# Altium project Yukitora.PrjPcb (part 1 of 5)
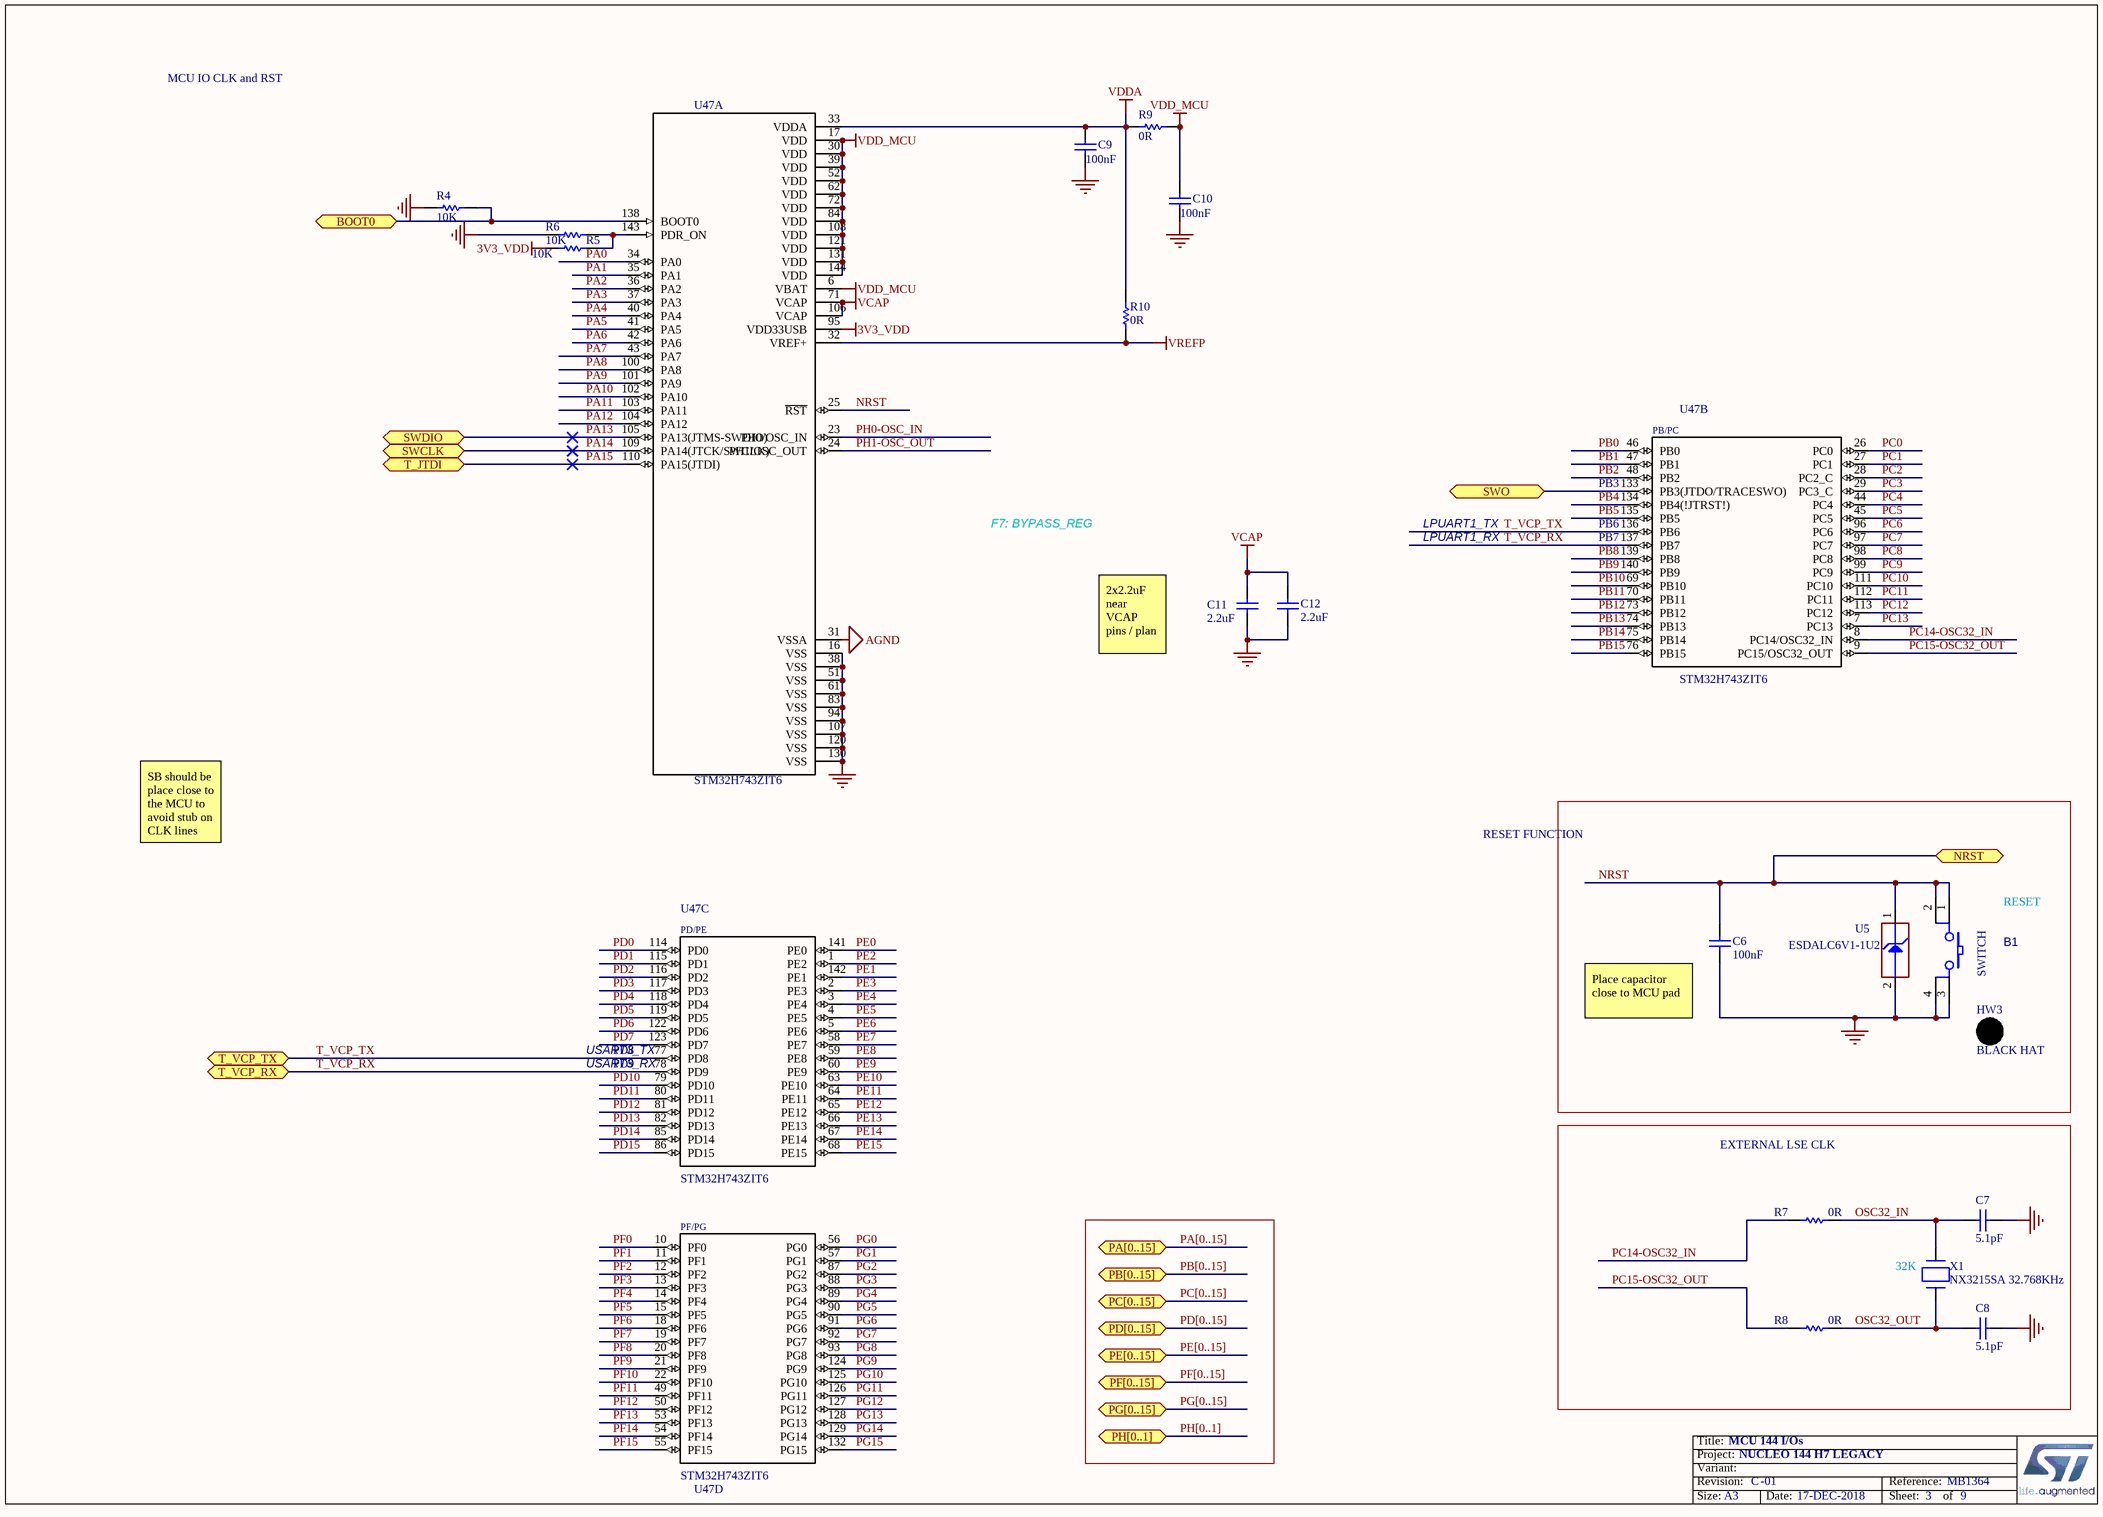
[diagram p0: MCU_144_IOs.SchDoc]
Board_Assembly_Revision: 01; Board_Document_Date: 17-DEC-2018; Board_Name: NUCLEO 144 H7 LEGACY; Board_PCB_Revision: C; Board_Reference: MB1364
17 sheets, 317 parts. Net scope: flat (ports and power ports of the same name join across sheets).
Board file: Yukitora.PcbDoc
Sheets:
  MCU_144_IOs.SchDoc
  MCU_144_POWER.SchDoc
  Power_Board.SchDoc
  ST_LINK_V3E.SchDoc
  Heater.SchDoc
  SynchDemod.SchDoc
  Levels.SchDoc
  12V_Supply.SchDoc
  Bluetooth.SchDoc
  Power.SchDoc
  Force_Plates_Power_Supply.SchDoc
  Conning_Tower.SchDoc
  ZPZH.SchDoc
  Encoder.SchDoc
  Motors.SchDoc
  AD717-2.SchDoc
  SYS_PWR_ADC.SchDoc

## Sheet MCU_144_IOs.SchDoc: MCU 144 I/Os
size A3; Date: Not used; ApprovedBy: Not used; CheckedBy: Not used; Author: Not used; CompanyName: STMicroelectronics; DrawnBy: Not used; Engineer: Not used; Organization: Not used; Address1: Not used; Address2: Not used; Address3: Not used; Address4: Not used; DocumentNumber: 3; Revision: Not used; SheetNumber: 3; SheetTotal: 9; CurrentTime: Not used; CurrentDate: Not used; Time: Not used; DocumentFullPathAndName: Not used; DocumentName: Not used; ModifiedDate: Not used; ImagePath: Not used; ProjectName: Not used; Application_BuildNumber: Not used

### Parts
B1  value SWITCH  [SWI_WEALTHMETAL_TD-0341_4P_BLACK]  (hidden comment: SW-PUSH-CMS)
C6  value 100nF  [C0603]  (hidden comment: Capacitor)
C7  value 5.1pF  [C0402]  (hidden comment: Capacitor)
C8  value 5.1pF  [C0402]  (hidden comment: Capacitor)
C9  Capacitance: 100nF  [C0402]  (hidden comment: Capacitor)
C10  Capacitance: 100nF  [C0402]  (hidden comment: Capacitor)
C11  value 2.2uF  [C0603]  (hidden comment: Capacitor)
C12  value 2.2uF  [C0603]  (hidden comment: Capacitor)
HW3  value BLACK HAT  (hidden comment: BUTTON_HAT_BLACK)  (mechanical)
R4  value 10K  [R0603]  (hidden comment: Resistor)
R5  value 10K  [R0603]  (hidden comment: Resistor)
R6  value 10K  [R0603]  (hidden comment: Resistor)
R7  value 0R  [R0603]  (hidden comment: Resistor)
R8  value 0R  [R0603]  (hidden comment: Resistor)
R9  value 0R  [R0603]  (hidden comment: Resistor)
R10  value 0R  [R0603]  (hidden comment: Resistor)
U5  value ESDALC6V1-1U2  [ESD_ST0201]  (hidden comment: ESD-TRANSIL)
U47  STM32H743ZIT6  [*QFP50P2200X2200X160-144N]  (parts A,B,C,D of 4)
X1  value NX3215SA 32.768KHz  [CRY_NX3215SA_2P]  (hidden comment: XTAL_2_PINS)

### Ports
BOOT0 (bidir), NRST (bidir), PA[0..15] (bidir), PB[0..15] (bidir), PC[0..15] (bidir), PD[0..15] (bidir), PE[0..15] (bidir), PF[0..15] (bidir), PG[0..15] (bidir), PH[0..1] (bidir), SWCLK (bidir), SWDIO (bidir), SWO (bidir), T_JTDI (bidir), T_VCP_RX (bidir), T_VCP_TX (bidir)

### Nets
3V3_VDD: R5.2 U47.95(VDD33USB)
AGND: U47.31(VSSA)
GND: B1.3 B1.4 C6.1 C7.2 C8.2 C9.1 C10.1 C11.1 C12.1 R4.2 R6.2 U5.2(GND) U47.16(VSS) U47.38(VSS) U47.51(VSS) U47.61(VSS) U47.83(VSS) U47.94(VSS) U47.107(VSS) U47.120(VSS) U47.130(VSS)
VCAP: C11.2 C12.2 U47.71(VCAP) U47.106(VCAP)
VDD_MCU: C10.2 R9.2 U47.6(VBAT) U47.17(VDD) U47.30(VDD) U47.39(VDD) U47.52(VDD) U47.62(VDD) U47.72(VDD) U47.84(VDD) U47.108(VDD) U47.121(VDD) U47.131(VDD) U47.144(VDD)
VDDA: C9.2 R9.1 R10.1 U47.33(VDDA)
VREFP: R10.2 U47.32(VREF+)
BOOT0: R4.1 U47.138(BOOT0) ; port BOOT0
NRST: B1.1 B1.2 C6.2 U5.1(IO1) U47.25(~{RST}) ; port NRST
OSC32_IN: C7.1 R7.2 X1.2(X2)
OSC32_OUT: C8.1 R8.2 X1.1(X1)
PA0: U47.34(PA0)
PA1: U47.35(PA1)
PA2: U47.36(PA2)
PA3: U47.37(PA3)
PA4: U47.40(PA4)
PA5: U47.41(PA5)
PA6: U47.42(PA6)
PA7: U47.43(PA7)
PA8: U47.100(PA8)
PA9: U47.101(PA9)
PA10: U47.102(PA10)
PA11: U47.103(PA11)
PA12: U47.104(PA12)
PA13: U47.105(PA13(JTMS-SWDIO)) ; port SWDIO
PA14: U47.109(PA14(JTCK/SWCLK)) ; port SWCLK
PA15: U47.110(PA15(JTDI)) ; port T_JTDI
PB0: U47.46(PB0)
PB1: U47.47(PB1)
PB2: U47.48(PB2)
PB4: U47.134(PB4(!JTRST!))
PB5: U47.135(PB5)
PB8: U47.139(PB8)
PB9: U47.140(PB9)
PB10: U47.69(PB10)
PB11: U47.70(PB11)
PB12: U47.73(PB12)
PB13: U47.74(PB13)
PB14: U47.75(PB14)
PB15: U47.76(PB15)
PC0: U47.26(PC0)
PC1: U47.27(PC1)
PC2: U47.28(PC2_C)
PC3: U47.29(PC3_C)
PC4: U47.44(PC4)
PC5: U47.45(PC5)
PC6: U47.96(PC6)
PC7: U47.97(PC7)
PC8: U47.98(PC8)
PC9: U47.99(PC9)
PC10: U47.111(PC10)
PC11: U47.112(PC11)
PC12: U47.113(PC12)
PC13: U47.7(PC13)
PC14-OSC32_IN: R7.1 U47.8(PC14/OSC32_IN)
PC15-OSC32_OUT: R8.1 U47.9(PC15/OSC32_OUT)
PD0: U47.114(PD0)
PD1: U47.115(PD1)
PD2: U47.116(PD2)
PD3: U47.117(PD3)
PD4: U47.118(PD4)
PD5: U47.119(PD5)
PD6: U47.122(PD6)
PD7: U47.123(PD7)
PD10: U47.79(PD10)
PD11: U47.80(PD11)
PD12: U47.81(PD12)
PD13: U47.82(PD13)
PD14: U47.85(PD14)
PD15: U47.86(PD15)
PE0: U47.141(PE0)
PE1: U47.142(PE1)
PE2: U47.1(PE2)
PE3: U47.2(PE3)
PE4: U47.3(PE4)
PE5: U47.4(PE5)
PE6: U47.5(PE6)
PE7: U47.58(PE7)
PE8: U47.59(PE8)
PE9: U47.60(PE9)
PE10: U47.63(PE10)
PE11: U47.64(PE11)
PE12: U47.65(PE12)
PE13: U47.66(PE13)
PE14: U47.67(PE14)
PE15: U47.68(PE15)
PF0: U47.10(PF0)
PF1: U47.11(PF1)
PF2: U47.12(PF2)
PF3: U47.13(PF3)
PF4: U47.14(PF4)
PF5: U47.15(PF5)
PF6: U47.18(PF6)
PF7: U47.19(PF7)
PF8: U47.20(PF8)
PF9: U47.21(PF9)
PF10: U47.22(PF10)
PF11: U47.49(PF11)
PF12: U47.50(PF12)
PF13: U47.53(PF13)
PF14: U47.54(PF14)
PF15: U47.55(PF15)
PG0: U47.56(PG0)
PG1: U47.57(PG1)
PG2: U47.87(PG2)
PG3: U47.88(PG3)
PG4: U47.89(PG4)
PG5: U47.90(PG5)
PG6: U47.91(PG6)
PG7: U47.92(PG7)
PG8: U47.93(PG8)
PG9: U47.124(PG9)
PG10: U47.125(PG10)
PG11: U47.126(PG11)
PG12: U47.127(PG12)
PG13: U47.128(PG13)
PG14: U47.129(PG14)
PG15: U47.132(PG15)
PH0-OSC_IN: U47.23(PH0/OSC_IN)
PH1-OSC_OUT: U47.24(PH1/OSC_OUT)
SWO: U47.133(PB3(JTDO/TRACESWO)) ; port SWO
T_VCP_RX: U47.78(PD9) U47.137(PB7) ; port T_VCP_RX
T_VCP_TX: U47.77(PD8) U47.136(PB6) ; port T_VCP_TX
NetR5_1: R5.1 R6.1 U47.143(PDR_ON)

### Buses and harness runs
bus PA[0..15] = port PA[0..15]
bus PB[0..15] = port PB[0..15]
bus PC[0..15] = port PC[0..15]
bus PD[0..15] = port PD[0..15]
bus PE[0..15] = port PE[0..15]
bus PF[0..15] = port PF[0..15]
bus PG[0..15] = port PG[0..15]
bus PH[0..1] = port PH[0..1]

### Notes on the sheet
- MCU IO CLK and RST
- (near U47) PB3
- F7: BYPASS_REG
- LPUART1_TX
- LPUART1_RX
- (near U47) PB6
- (near U47) PB7
- 2x2.2uF near VCAP pins / plan
- SB should be place close to the MCU to avoid stub on CLK lines
- RESET FUNCTION
- RESET
- USART3_TX
- (near U47) PD8
- (near C6) Place capacitor close to MCU pad
- USART3_RX
- (near U47) PD9
- EXTERNAL LSE CLK
- (near X1) 32K
- Title:
- Project:
- Size:
- Revision:
- Variant:
- A3
- -
- Date:
- Reference:
- Sheet:
- of
- (in symbol STM32H743ZIT6, part B) PB/PC
- (in symbol STM32H743ZIT6, part C) PD/PE
- (in symbol STM32H743ZIT6, part D) PF/PG

### Library data of the parts
B1 = MCD-00001: Non-Open Push-Button 0.1A 24V BLACK; Manufacturer_Part_Number: TD-0341; Manufacturer: WEALTHMETAL; Part_Type: Misc; Provided_By: SUBCO; Internal_Part_Number: MCD-00001; ComponentLink1Description: Datasheet; Status: Released; ComponentLink1URL: http://tunmcdsvn.tun.st.com/Component_Datasheet_Library/Trunk/Misc/Wealthmetal_Tact-Switch_TD0341; ECCN_US: n/a; ECCN_EU: n/a
C6 = MCD-00237: Capacitor, MLCC, 100nF, 6V3, X5R, 10%, 0603, T=0,8mm; Manufacturer_Part_Number: CC0603KRX5R5BB104; Manufacturer: YAGEO; Provided_By: SUBCO; ECCN_US: EAR99; ECCN_EU: NEC; Internal_Part_Number: MCD-00237; ComponentLink1Description: Datasheet; Status: Released; Part_Type: Capacitor; Package: C0603; ComponentLink1URL: http://tunmcdsvn.tun.st.com/Component_Datasheet_Library/Trunk/Capacitors/Yageo_Multilayer_capacitor_X5R_series_100pF_to_100uF
C7 C8 = MCD-00003: Capacitor, MLCC, 5.1pF, 50V, NPO, +-0.25pF, 0402, T=0.5mm; Manufacturer_Part_Number: CC0402CRNPO9BN5R1; Manufacturer: YAGEO; Provided_By: SUBCO; ECCN_US: EAR99; ECCN_EU: NEC; Internal_Part_Number: MCD-00003; ComponentLink1Description: Datasheet; Status: Released; Part_Type: Capacitor; Package: C0402; ComponentLink1URL: http://tunmcdsvn.tun.st.com/Component_Datasheet_Library/Trunk/Capacitors/Yageo_Capacitor_NP0_16V-to-50V
C9 C10 = MCD-01123: CAP CER 0.1UF 16V X7R 0402; Manufacturer: Yageo; Manufacturer Part Number: CC0402KRX7R7BB104; Tolerance: 10%; Supplier 1: Mouser; Supplier Part Number 1: 603-CC402KRX7R7BB104; Stock 1: 164534511; Pricing 1: 1=0.10000, 10=0.02700, 50=0.02700, 100=0.01200, 1000=0.00700, 2500=0.00600, 10000=0.00500, 20000=0.00400 (USD); RoHS: Yes; Mount: Surface Mount; Case/Package: 0402; Number of Pins: 2; Case Code (Metric): 1005; Case Code (Imperial): 0402; Min Operating Temperature: -55°C; Max Operating Temperature: 125°C; Dielectric: X7R; Voltage Rating: 16V; Voltage Rating (DC): 16V; Packaging: Tape and Reel; Package Quantity: 1; Termination: SMD/SMT; Composition: Ceramic; Voltage: 16V; Length: 1mm; Height: 0.5mm; Width: 0.02inch; Thickness: 0.022inch; Depth: 0.5mm; Radiation Hardening: No; REACH SVHC: No SVHC; Lead Free: Lead Free; Halogen Free: Halogen Free; ComponentLink1URL: https://datasheet.ciiva.com/11788/0900766b80ce67ed-11788364.pdf?src-supplier=RSComponents; ComponentLink1Description: https://datasheet.ciiva.com/11788/0900766b80ce67ed-11788364.pdf?src-supplier=RSComponents; ComponentLink2URL: https://datasheet.ciiva.com/16625/upy-gphc-x7r-6-3v-to-50v-8-16625511.pdf?src-supplier=Avnet+Europe; ComponentLink2Description: https://datasheet.ciiva.com/16625/upy-gphc-x7r-6-3v-to-50v-8-16625511.pdf?src-supplier=Avnet+Europe; ComponentLink3URL: https://datasheet.ciiva.com/161/mlccorderingcode-161544.pdf?src-supplier=Digi-Key; ComponentLink3Description: https://datasheet.ciiva.com/161/mlccorderingcode-161544.pdf?src-supplier=Digi-Key; ComponentLink4URL: https://datasheet.ciiva.com/11587/upy-gphc-x7r-6-3v-to-50v-8-11587305.pdf?src-supplier=Avnet; ComponentLink4Description: https://datasheet.ciiva.com/11587/upy-gphc-x7r-6-3v-to-50v-8-11587305.pdf?src-supplier=Avnet; ComponentLink5URL: https://datasheet.ciiva.com/161/mlccorderingcode-161546.pdf?src-supplier=Digi-Key; ComponentLink5Description: https://datasheet.ciiva.com/161/mlccorderingcode-161546.pdf?src-supplier=Digi-Key; ComponentLink6URL: https://datasheet.ciiva.com/7978/1489800-7978111.pdf?src-supplier=Element14; ComponentLink6Description: https://datasheet.ciiva.com/7978/1489800-7978111.pdf?src-supplier=Element14; ComponentLink7URL: https://datasheet.ciiva.com/161/mlccorderingcode-161545.pdf?src-supplier=Digi-Key; ComponentLink7Description: https://datasheet.ciiva.com/161/mlccorderingcode-161545.pdf?src-supplier=Digi-Key; ComponentLink8URL: https://datasheet.ciiva.com/13395/upy-gphc-x7r-6-3v-to-50v-8-13395676.pdf?src-supplier=Mouser; ComponentLink8Description: https://datasheet.ciiva.com/13395/upy-gphc-x7r-6-3v-to-50v-8-13395676.pdf?src-supplier=Mouser; ComponentLink9URL: https://datasheet.ciiva.com/8033/1734573-8033661.pdf?src-supplier=Element14; ComponentLink9Description: https://datasheet.ciiva.com/8033/1734573-8033661.pdf?src-supplier=Element14; ComponentLink10URL: https://datasheet.ciiva.com/8033/1734573-8033663.pdf?src-supplier=Element14; ComponentLink10Description: https://datasheet.ciiva.com/8033/1734573-8033663.pdf?src-supplier=Element14; ComponentLink11URL: https://datasheet.ciiva.com/28450/1489800-28450335.pdf?src-supplier=Element14; ComponentLink11Description: https://datasheet.ciiva.com/28450/1489800-28450335.pdf?src-supplier=Element14
C11 C12 = MCD-00012: Capacitor, MLCC, 2.2uF, 10V, X5R, 10%, 0603, T=0,8mm; Manufacturer_Part_Number: CC0603KRX5R6BB225; Manufacturer: YAGEO; Alternate_Manufacturer_Part_Number: C0603C225K8PACTU; Alternate_Manufacturer: KEMET; Provided_By: SUBCO; ECCN_US: EAR99; ECCN_EU: NEC; Internal_Part_Number: MCD-00012; Status: Released; Part_Type: Capacitor; Package: C0603; ComponentLink1Description: Datasheet; ComponentLink1URL: http://tunmcdsvn.tun.st.com/Component_Datasheet_Library/Trunk/Capacitors/Yageo_Multilayer_capacitor_X5R_series_100pF_to_100uF
HW3 = MCD-00635: Black Hat for switch TD0341X-G01-BLA; Part_Type: Mechanical; Manufacturer_Part_Number: 988.16.09.3.00003_SH-517; Manufacturer: JIUBABA; Provided_By: SUBCO; Internal_Part_Number: MCD-00635; Status: Released; ComponentLink1Description: Datasheet; ComponentLink1URL: http://tunmcdsvn.tun.st.com/Component_Datasheet_Library/Trunk/Mechanical/Jiubaba_HAT_SH-517; ECCN_US: n/a; ECCN_EU: n/a
R4-R6 = MCD-00220: Resistor,10K,0603,1%,1/10W; Manufacturer_Part_Number: RC0603FR-0710KL; Manufacturer: YAGEO; Provided_By: SUBCO; ECCN_US: EAR99; ECCN_EU: NEC; Internal_Part_Number: MCD-00220; Status: Released; Part_Type: Resistor; ComponentLink1Description: Datasheet; Package: R0603; ComponentLink1URL: http://tunmcdsvn.tun.st.com/Component_Datasheet_Library/Trunk/Resistors/Yageo_Resistor_RC0603-series
R7-R10 = MCD-00056: Resistor,0R,0603,5%,1/10W; Manufacturer_Part_Number: RC0603JR-070RL; Manufacturer: YAGEO; Provided_By: SUBCO; ECCN_US: EAR99; ECCN_EU: NEC; Internal_Part_Number: MCD-00056; ComponentLink1Description: Datasheet; Status: Released; Part_Type: Resistor; Package: R0603; ComponentLink1URL: http://tunmcdsvn.tun.st.com/Component_Datasheet_Library/Trunk/Resistors/Yageo_Resistor_RC0603-series
U5 = MCD-00170: ESD protection 6V1; Part_Type: Diode; Manufacturer: STMICROELECTRONICS; BMS_Part_Number: 9151132; Provided_By: SUBCO with ST control; ECCN_US: EAR99; ECCN_EU: NEC; Internal_Part_Number: MCD-00170; Status: Released; Manufacturer_Part_Number: ESDALC6V1-1U2; ComponentLink1Description: Datasheet; ComponentLink1URL: http://tunmcdsvn.tun.st.com/Component_Datasheet_Library/Trunk/Diodes/STM_ESD_ESDALC6V1-1U2
U47 = STM32H743ZIT6: High-performance and DSP with DP-FPU, ARM Cortex-M7 MCU with 2MBytes Flash, 1MB RAM, 400 MHz CPU, Art Accelerator, L1...; MF: STMicroelectronics; SnapEDA_Link: https://www.snapeda.com/parts/STM32H743ZIT6/STMicroelectronics/view-part/?ref=snap; MP: STM32H743ZIT6; Package: LQFP-144 STMicroelectronics; Digi-Key_Purchase_URL: https://www.digikey.com/product-detail/en/stmicroelectronics/STM32H743ZIT6/497-17721-ND/7809238?utm_source=snapeda&utm_medium=aggregator&utm_campaign=symbol; Digi-Key_Part_Number: 497-17721-ND; Value: *
X1 = MCD-00091: Crystal 32.768kHz, 6pF, +-20ppm, 50Kohms max, SMD; Manufacturer_Part_Number: NX3215SA 32.768KHz EXS00A-MU00525; Manufacturer: NDK; Part_Type: Crystal_Osc; BMS_Part_Number: 9157034; Provided_By: SUBCO; ECCN_US: EAR99; ECCN_EU: NEC; Internal_Part_Number: MCD-00091; ComponentLink1Description: Datasheet; Status: Released; ComponentLink1URL: http://tunmcdsvn.tun.st.com/Component_Datasheet_Library/Trunk/Crystal_Osc/NDK_Crystal-For-ST_NX3215SA 32.768KHz EXS00A-MU00525 (EXS10B-21238); Order_Code_Digikey: 644-1386

## Sheet MCU_144_POWER.SchDoc: MCU 144 POWER
size OrCAD A; Date: Not used; ApprovedBy: Not used; CheckedBy: Not used; Author: Not used; CompanyName: STMicroelectronics; DrawnBy: Not used; Engineer: Not used; Organization: Not used; Address1: Not used; Address2: Not used; Address3: Not used; Address4: Not used; DocumentNumber: 4; Revision: Not used; SheetNumber: 4; SheetTotal: 9; CurrentTime: Not used; CurrentDate: Not used; Time: Not used; DocumentFullPathAndName: Not used; DocumentName: Not used; ModifiedDate: Not used; ImagePath: Not used; ProjectName: Not used; Application_BuildNumber: Not used
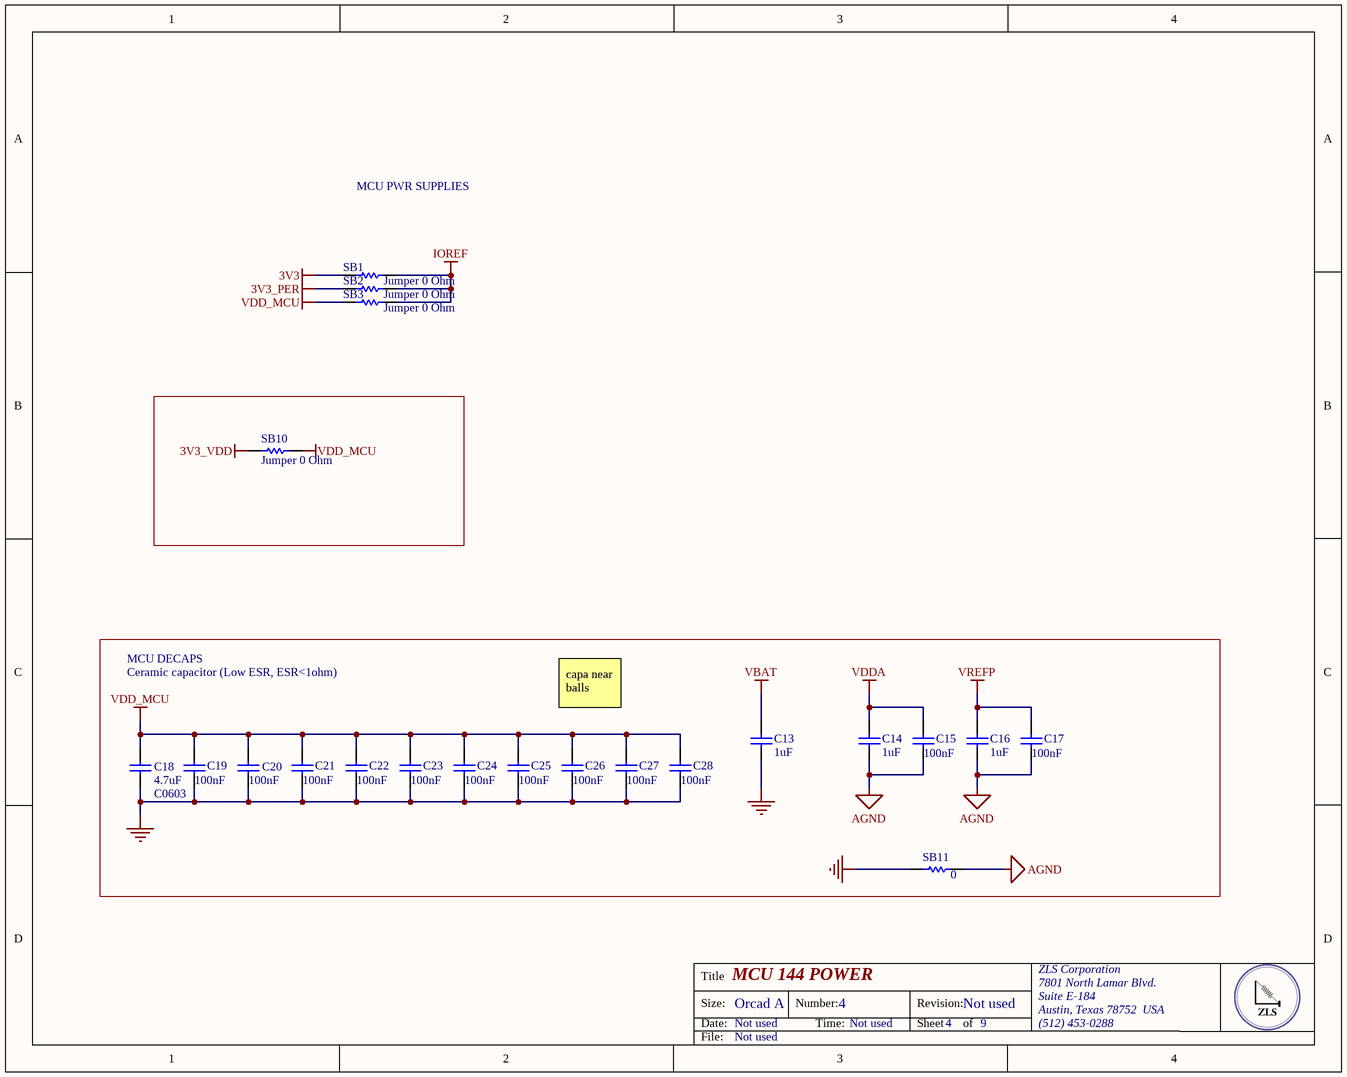
[diagram p1: MCU_144_POWER.SchDoc]

### Parts
C13  value 1uF  [C0603]  (hidden comment: Capacitor)
C14  value 1uF  [C0603]  (hidden comment: Capacitor)
C15  Capacitance: 100nF  [C0402]  (hidden comment: Capacitor)
C16  value 1uF  [C0603]  (hidden comment: Capacitor)
C17  Capacitance: 100nF  [C0402]  (hidden comment: Capacitor)
C18  value 4.7uF  [C0603]  (hidden comment: Capacitor)
C19  Capacitance: 100nF  [C0402]  (hidden comment: Capacitor)
C20  Capacitance: 100nF  [C0402]  (hidden comment: Capacitor)
C21  Capacitance: 100nF  [C0402]  (hidden comment: Capacitor)
C22  Capacitance: 100nF  [C0402]  (hidden comment: Capacitor)
C23  Capacitance: 100nF  [C0402]  (hidden comment: Capacitor)
C24  Capacitance: 100nF  [C0402]  (hidden comment: Capacitor)
C25  Capacitance: 100nF  [C0402]  (hidden comment: Capacitor)
C26  Capacitance: 100nF  [C0402]  (hidden comment: Capacitor)
C27  Capacitance: 100nF  [C0402]  (hidden comment: Capacitor)
C28  Capacitance: 100nF  [C0402]  (hidden comment: Capacitor)
SB1  Jumper 0 Ohm  [RESC1608X55X25ML10T15]
SB2  Jumper 0 Ohm  [RESC1608X55X25ML10T15]
SB3  Jumper 0 Ohm  [RESC1608X55X25ML10T15]
SB10  Jumper 0 Ohm  [RESC1608X55X25ML10T15]
SB11  0  [RESC1608X55X25ML10T15]

### Nets
3V3: SB1.1
3V3_PER: SB2.1
3V3_VDD: SB10.1
AGND: C14.2 C15.1 C16.2 C17.1 SB11.2
GND: C13.1 C18.1 C19.1 C20.1 C21.1 C22.1 C23.1 C24.1 C25.1 C26.1 C27.1 C28.1 SB11.1
IOREF: SB1.2 SB2.2 SB3.2
VBAT: C13.2
VDD_MCU: C18.2 C19.2 C20.2 C21.2 C22.2 C23.2 C24.2 C25.2 C26.2 C27.2 C28.2 SB3.1 SB10.2
VDDA: C14.1 C15.2
VREFP: C16.1 C17.2

### Notes on the sheet
- MCU PWR SUPPLIES
- MCU DECAPS
- Ceramic capacitor (Low ESR, ESR<1ohm)
- capa near balls
- Title
- Size:
- Date:
- Orcad A
- Number:
- Time:
- Revision:
- Sheet
- of
- ZLS Corporation
- 7801 North Lamar Blvd.
- Suite E-184
- Austin, Texas 78752  USA
- (512) 453-0288
- File:

### Library data of the parts
C13 C14 C16 = MCD-00238: Capacitor, MLCC, 1uF, 6V3, X5R, 10%, 0603, T=0,8mm; Manufacturer_Part_Number: CC0603KRX5R5BB105; Manufacturer: YAGEO; Provided_By: SUBCO; ECCN_US: EAR99; ECCN_EU: NEC; Internal_Part_Number: MCD-00238; Status: Released; Part_Type: Capacitor; Package: C0603; ComponentLink1Description: Datasheet; ComponentLink1URL: http://tunmcdsvn.tun.st.com/Component_Datasheet_Library/Trunk/Capacitors/Yageo_Multilayer_capacitor_X5R_series_100pF_to_100uF
C15 C17 C19-C28 = MCD-01123: as C9 on sheet MCU_144_IOs; Supplier 1: Mouser; Supplier Part Number 1: 603-CC402KRX7R7BB104; Stock 1: 164534511; Pricing 1: 1=0.10000, 10=0.02700, 50=0.02700, 100=0.01200, 1000=0.00700, 2500=0.00600, 10000=0.00500, 20000=0.00400 (USD); RoHS: Yes; Mount: Surface Mount; Case/Package: 0402; Number of Pins: 2; Case Code (Metric): 1005; Case Code (Imperial): 0402; Min Operating Temperature: -55°C; Max Operating Temperature: 125°C; Dielectric: X7R; Voltage Rating: 16V; Voltage Rating (DC): 16V; Packaging: Tape and Reel; Package Quantity: 1; Termination: SMD/SMT; Composition: Ceramic; Voltage: 16V; Length: 1mm; Height: 0.5mm; Width: 0.02inch; Thickness: 0.022inch; Depth: 0.5mm; Radiation Hardening: No; REACH SVHC: No SVHC; Lead Free: Lead Free; Halogen Free: Halogen Free; ComponentLink1URL: https://datasheet.ciiva.com/11788/0900766b80ce67ed-11788364.pdf?src-supplier=RSComponents; ComponentLink1Description: https://datasheet.ciiva.com/11788/0900766b80ce67ed-11788364.pdf?src-supplier=RSComponents; ComponentLink2URL: https://datasheet.ciiva.com/16625/upy-gphc-x7r-6-3v-to-50v-8-16625511.pdf?src-supplier=Avnet+Europe; ComponentLink2Description: https://datasheet.ciiva.com/16625/upy-gphc-x7r-6-3v-to-50v-8-16625511.pdf?src-supplier=Avnet+Europe; ComponentLink3URL: https://datasheet.ciiva.com/161/mlccorderingcode-161544.pdf?src-supplier=Digi-Key; ComponentLink3Description: https://datasheet.ciiva.com/161/mlccorderingcode-161544.pdf?src-supplier=Digi-Key; ComponentLink4URL: https://datasheet.ciiva.com/11587/upy-gphc-x7r-6-3v-to-50v-8-11587305.pdf?src-supplier=Avnet; ComponentLink4Description: https://datasheet.ciiva.com/11587/upy-gphc-x7r-6-3v-to-50v-8-11587305.pdf?src-supplier=Avnet; ComponentLink5URL: https://datasheet.ciiva.com/161/mlccorderingcode-161546.pdf?src-supplier=Digi-Key; ComponentLink5Description: https://datasheet.ciiva.com/161/mlccorderingcode-161546.pdf?src-supplier=Digi-Key; ComponentLink6URL: https://datasheet.ciiva.com/7978/1489800-7978111.pdf?src-supplier=Element14; ComponentLink6Description: https://datasheet.ciiva.com/7978/1489800-7978111.pdf?src-supplier=Element14; ComponentLink7URL: https://datasheet.ciiva.com/161/mlccorderingcode-161545.pdf?src-supplier=Digi-Key; ComponentLink7Description: https://datasheet.ciiva.com/161/mlccorderingcode-161545.pdf?src-supplier=Digi-Key; ComponentLink8URL: https://datasheet.ciiva.com/13395/upy-gphc-x7r-6-3v-to-50v-8-13395676.pdf?src-supplier=Mouser; ComponentLink8Description: https://datasheet.ciiva.com/13395/upy-gphc-x7r-6-3v-to-50v-8-13395676.pdf?src-supplier=Mouser; ComponentLink9URL: https://datasheet.ciiva.com/8033/1734573-8033661.pdf?src-supplier=Element14; ComponentLink9Description: https://datasheet.ciiva.com/8033/1734573-8033661.pdf?src-supplier=Element14; ComponentLink10URL: https://datasheet.ciiva.com/8033/1734573-8033663.pdf?src-supplier=Element14; ComponentLink10Description: https://datasheet.ciiva.com/8033/1734573-8033663.pdf?src-supplier=Element14; ComponentLink11URL: https://datasheet.ciiva.com/28450/1489800-28450335.pdf?src-supplier=Element14; ComponentLink11Description: https://datasheet.ciiva.com/28450/1489800-28450335.pdf?src-supplier=Element14
C18 = MCD-01121: Capacitor, MLCC, 4.7µF, 10V, X5R, 20%, 0603, T=0,8mm; Manufacturer_Part_Number: GRM188R61A475ME15; Manufacturer: MURATA; Provided_By: SUBCO; ECCN_US: EAR99; ECCN_EU: NEC; Internal_Part_Number: MCD-01121; Status: Released; Part_Type: Capacitor; Package: C0603; ComponentLink1Description: Datasheet; ComponentLink1URL: http://tunmcdsvn.tun.st.com/Component_Datasheet_Library/Trunk/Capacitors/Murata_Capacitor_GR_series
SB1-SB3 SB10 SB11 = CMP-2100-03667-1: Chip Resistor, 0 Ohm, +/- 5%, 0.1 W, -55 to 155 degC, 0603 (1608 Metric), RoHS, Tape and Reel; Manufacturer: Yageo; Manufacturer Part Number: RC0603JR-070RL; Temperature Coefficient: 200ppm/degreesC; Voltage Rating: 50V; Power Rating: 100mW; Resistance: 0mOhm; Width: 0.8mm; Max Operating Temperature: 155degC; Tolerance: 5%; Package Reference: 0603; Height: 0.45mm; Depth: 0.8mm; Package Description: 2-Pin Surface Mount Device, Body 1.6 x 0.8 mm; Termination: SMD/SMT; Package Quantity: 5000; Case/Package: 0603; Case Code (Imperial): 0603; Radiation Hardening: No; Number of Pins: 2; Length: 1.6mm; Lead Free: LeadFree; Voltage Rating (DC): 50V; Military Standard: Not; Datasheet URL: http://www.yageo.com/NewPortal/yageodocoutput?fileName=/pdf/R-Chip/PYu-RC_Group_51_RoHS_L_5.pdf; Manufacturer URL: http://www.yageo.com/; Packaging: TapeandReel; Case Code (Metric): 1608; Min Operating Temperature: -55degC; Composition: ThickFilm; RoHSCompliant: true; Contact Plating: Tin; Datasheet Version: Rev. 5, 10/2016; REACH SVHC: NoSVHC; Supplier 1: Digi-Key; Supplier Part Number 1: 311-0.0GRCT-ND; Stock 1: 41068279; Pricing 1: 1=0.10000, 10=0.02200, 25=0.01560, 50=0.01200, 100=0.00880, 250=0.00672, 500=0.00538, 1000=0.00396 (USD); RoHS: Yes; ComponentLink1URL: https://datasheet.ciiva.com/11808/pyu-r-int-6-11808700.pdf?src-supplier=RSComponents; ComponentLink1Description: https://datasheet.ciiva.com/11808/pyu-r-int-6-11808700.pdf?src-supplier=RSComponents; ComponentLink2URL: https://datasheet.ciiva.com/7746/1738695-7746421.pdf?src-supplier=Element14; ComponentLink2Description: https://datasheet.ciiva.com/7746/1738695-7746421.pdf?src-supplier=Element14; ComponentLink3URL: https://datasheet.ciiva.com/8883/pyu-rc0603-51-rohs-l-4-8883045.pdf?src-supplier=Avnet; ComponentLink3Description: https://datasheet.ciiva.com/8883/pyu-rc0603-51-rohs-l-4-8883045.pdf?src-supplier=Avnet; ComponentLink4URL: https://datasheet.ciiva.com/15189/getdatasheetpartid-329462-15189845.pdf?src-supplier=Verical; ComponentLink4Description: https://datasheet.ciiva.com/15189/getdatasheetpartid-329462-15189845.pdf?src-supplier=Verical; ComponentLink5URL: https://datasheet.ciiva.com/7746/1738695-7746422.pdf?src-supplier=Element14; ComponentLink5Description: https://datasheet.ciiva.com/7746/1738695-7746422.pdf?src-supplier=Element14; ComponentLink6URL: https://datasheet.ciiva.com/12555/rc0603-272842-12555254.pdf?src-supplier=Mouser; ComponentLink6Description: https://datasheet.ciiva.com/12555/rc0603-272842-12555254.pdf?src-supplier=Mouser; ComponentLink7URL: https://datasheet.ciiva.com/22747/443971-22747530.pdf?src-supplier=Element14; ComponentLink7Description: https://datasheet.ciiva.com/22747/443971-22747530.pdf?src-supplier=Element14

## Sheet Power_Board.SchDoc: MAIN POWER 5V / 3V3 / 1V8
size A4; Date: Not used; ApprovedBy: Not used; CheckedBy: Not used; Author: Not used; CompanyName: STMicroelectronics; DrawnBy: Not used; Engineer: Not used; Organization: Not used; Address1: Not used; Address2: Not used; Address3: Not used; Address4: Not used; DocumentNumber: 9; Revision: Not used; SheetNumber: 8; SheetTotal: 9; CurrentTime: Not used; CurrentDate: Not used; Time: Not used; DocumentFullPathAndName: Not used; DocumentName: Not used; ModifiedDate: Not used; ImagePath: Not used; ProjectName: Not used; Application_BuildNumber: Not used
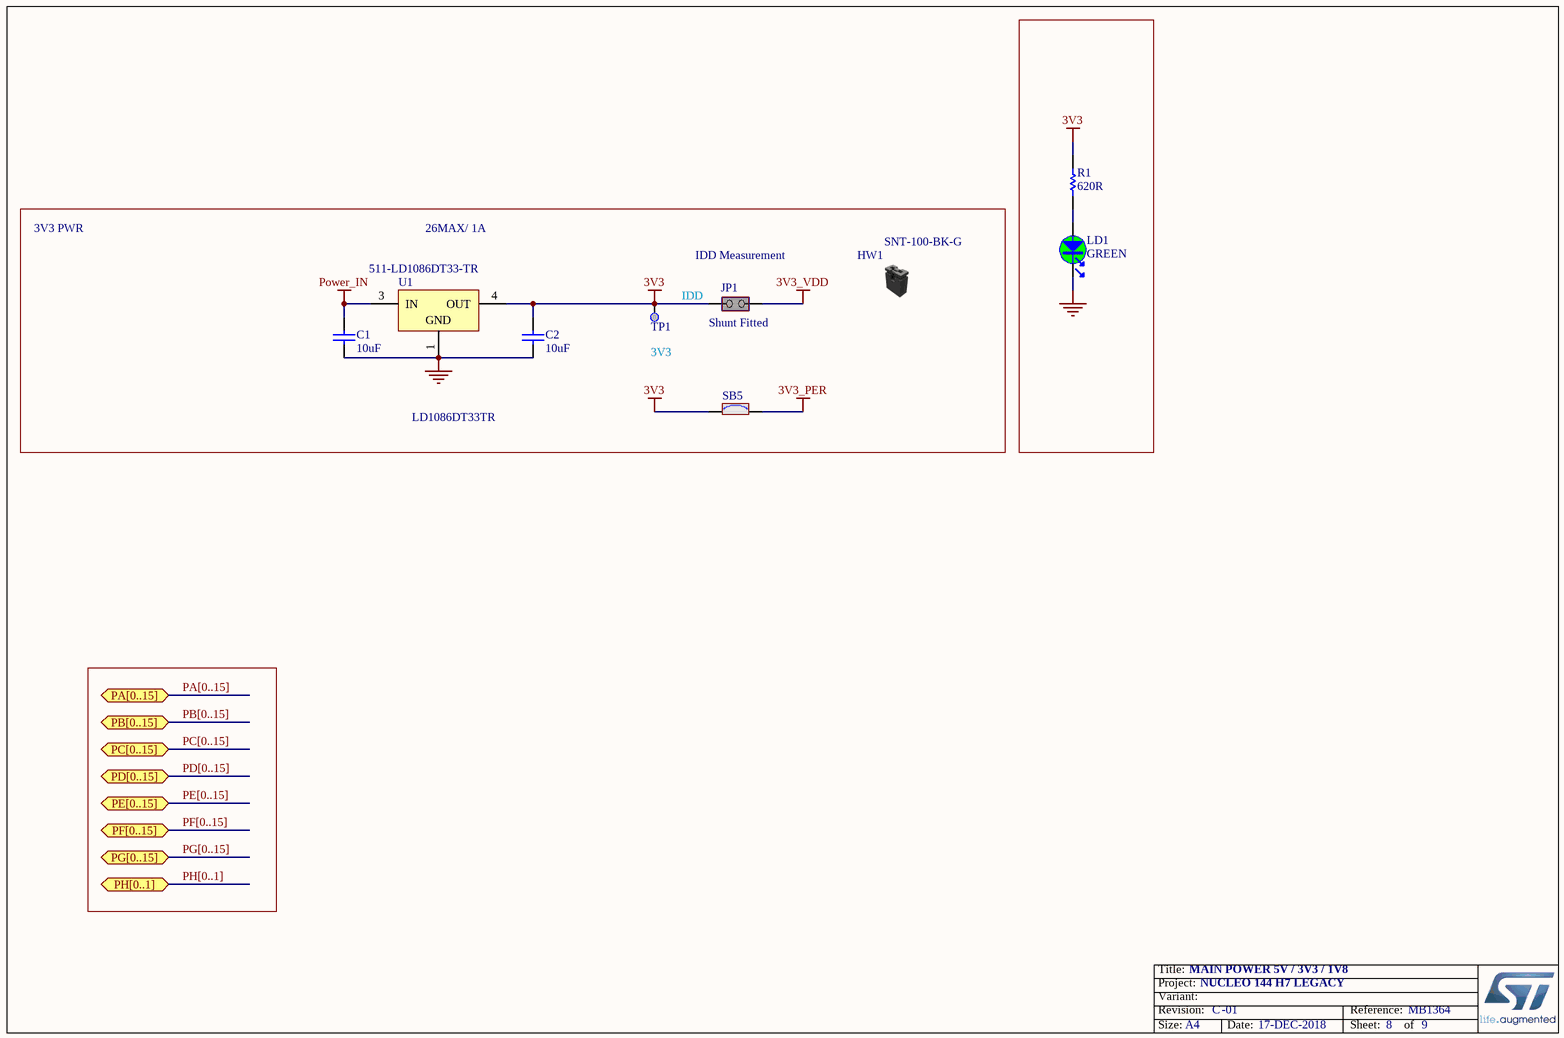
[diagram p2: Power_Board.SchDoc]

### Parts
C1  value 10uF  [C0805]  (hidden comment: Capacitor)
C2  value 10uF  [C0805]  (hidden comment: Capacitor)
HW1  value SNT-100-BK-G  (hidden comment: Shunt Black 2.54mm)  (mechanical)
JP1  value Shunt Fitted  [CON_SAMTEC_TSW-102-07-G-S]  (hidden comment: Jumper_Header 2x1 Fitted)
LD1  value GREEN  [LED_0603_OSRAM_LG-Q396-PS-35_GREEN_1A2K_H0P4]  (hidden comment: LED_green)
R1  value 620R  [R0603]  (hidden comment: Resistor)
SB5  SB_ON  [SOLDER-BRIDGE_R0603-0R]  (value not drawn)
TP1  Test Point  [TP_SMD_1MM]  (value not drawn)  (no BOM)
U1  LD1086DT33TR  Supplier Part Number 1: 511-LD1086DT33-TR  [TO-252_L]

### Ports
PA[0..15] (bidir), PB[0..15] (bidir), PC[0..15] (bidir), PD[0..15] (bidir), PE[0..15] (bidir), PF[0..15] (bidir), PG[0..15] (bidir), PH[0..1] (bidir)

### Nets
3V3: C2.2 JP1.1(COMMON) R1.2 SB5.1 TP1.1 U1.4(OUT)
3V3_PER: SB5.2
3V3_VDD: JP1.2(NO)
GND: C1.1 C2.1 LD1.2 U1.1(GND)
Power_IN: C1.2 U1.3(IN)
NetLD1_1: LD1.1 R1.1

### Buses and harness runs
bus PA[0..15] = port PA[0..15]
bus PB[0..15] = port PB[0..15]
bus PC[0..15] = port PC[0..15]
bus PD[0..15] = port PD[0..15]
bus PE[0..15] = port PE[0..15]
bus PF[0..15] = port PF[0..15]
bus PG[0..15] = port PG[0..15]
bus PH[0..1] = port PH[0..1]

### Notes on the sheet
- 3V3 PWR
- 26MAX/ 1A
- IDD
- (near JP1) IDD Measurement
- (near TP1) 3V3
- Title:
- Project:
- Size:
- Revision:
- Variant:
- A4
- -
- Date:
- Reference:
- Sheet:
- of

### Library data of the parts
C1 C2 = MCD-00014: Capacitor, MLCC, 10uF, 25V, X5R, 10%, 0805, T=0,85mm; Manufacturer_Part_Number: CC0805KRX5R8BB106; Manufacturer: YAGEO; Provided_By: SUBCO; ECCN_US: EAR99; ECCN_EU: NEC; Internal_Part_Number: MCD-00014; ComponentLink1Description: Datasheet; Status: Released; Part_Type: Capacitor; Package: C0805; ComponentLink1URL: http://tunmcdsvn.tun.st.com/Component_Datasheet_Library/Trunk/Capacitors/Yageo_Multilayer_capacitor_X5R_series_100pF_to_100uF
HW1 = MCD-00043: SHUNT 2.54mm BLACK; Manufacturer: SAMTEC; Part_Type: Mechanical; Alternate_Manufacturer_Part_Number: 316102S111A; Alternate_Manufacturer: JIUBABA; Provided_By: SUBCO; Internal_Part_Number: MCD-00043; Manufacturer_Part_Number: SNT-100-BK-G; ComponentLink1Description: Datasheet; Status: Released; ComponentLink1URL: http://tunmcdsvn.tun.st.com/Component_Datasheet_Library/Trunk/Connectors/Samtec_Shunt_Jumper_SNT100; ECCN_US: n/a; ECCN_EU: n/a
JP1 = MCD-00683: Header, 2x1, 2,54mm, VR, TH, Height 5.84mm/2.54mm - Shunt Fitted by default; Part_Type: Connector; Manufacturer_Part_Number: TSW-102-07-x-S; Manufacturer: SAMTEC; Alternate_Manufacturer_Part_Number: 313102S111116; Alternate_Manufacturer: LIANYI; Provided_By: SUBCO; Internal_Part_Number: MCD-00683; Status: Released; ComponentLink1Description: Datasheet; ComponentLink1URL: http://tunmcdsvn.tun.st.com/Component_Datasheet_Library/Trunk/Connectors/Samtec_TSW-HTSW-series; ECCN_US: n/a; ECCN_EU: n/a
LD1 = MCD-00588: LED Green, 0603 SMD, Forward Voltage Typ=2V, Max=2.5V; Part_Type: Display; Manufacturer_Part_Number: LG Q396-PS-35; Manufacturer: OSRAM OPTO SEMICONDUCTORS; Alternate_Manufacturer_Part_Number: VLMTG1300-GS08; Alternate_Manufacturer: VISHAY SEMICONDUCTOR OPTO DIVISION; Provided_By: SUBCO; Internal_Part_Number: MCD-00588; Status: Released; Package: LED 0603; ComponentLink1Description: Datasheet; ComponentLink1URL: http://tunmcdsvn.tun.st.com/Component_Datasheet_Library/Trunk/Display/OSRAM_LED_GREEN_LG Q396-PS-35; Order_Code_Digikey: LG Q396-PS-35-ND; ECCN_US: n/a; ECCN_EU: n/a
R1 = MCD-00500: Resistor,620R,0603,1%,1/10W; Manufacturer_Part_Number: RC0603FR-07620RL; Manufacturer: YAGEO; Provided_By: SUBCO; ECCN_US: EAR99; ECCN_EU: NEC; Internal_Part_Number: MCD-00500; Status: Released; Part_Type: Resistor; Package: R0603; ComponentLink1Description: Datasheet; ComponentLink1URL: http://tunmcdsvn.tun.st.com/Component_Datasheet_Library/Trunk/Resistors/Yageo_Resistor_RC0603-series
SB5 = MCD-00071: Solder Bridge ON; Part_Type: Mechanical; Manufacturer_Part_Number: RC0603JR-070RL; Manufacturer: YAGEO; Provided_By: SUBCO; Internal_Part_Number: MCD-00071; Status: Released; ComponentLink1Description: Datasheet; Package: SB0603; ComponentLink1URL: http://tunmcdsvn.tun.st.com/Component_Datasheet_Library/Trunk/Resistors/Yageo_Resistor_RC0603-series; ECCN_US: n/a; ECCN_EU: n/a
TP1 = MCD-00074: Test Point 1mm; Part_Type: Mechanical; Internal_Part_Number: MCD-00074; Provided_By: n/a; Status: Released; ComponentLink1Description: Datasheet; ComponentLink1URL: http://na; Manufacturer: n/a; Manufacturer_Part_Number: n/a; ECCN_US: n/a; ECCN_EU: n/a
U1 = CMP-0244-00125-1: 1.5A, Low Drop Positive Voltage Regulator, 3.3V, 3-Pin DPAK, Tape and Reel; Manufacturer: STMicroelectronics; Description: STMICROELECTRONICS         LD1086DT33TR            Fixed LDO Voltage Regulator, 6.3V to 30V, 1.3V Dropout, 3.3Vout, 1.5Aout, TO-252-3; Number of Outputs: 1; Max Input Voltage: 30V; Dropout Voltage: 1.3V; Quiescent Current: 10mA; Accuracy: 1%; Output Type: Fixed; Min Input Voltage: 6.3V; Input Bias Current: 5mA; ComponentLink2URL: http://www.st.com/internet/com/TECHNICAL_RESOURCES/TECHNICAL_LITERATURE/DATASHEET/CD00001884.pdf; ComponentLink1URL: http://www.st.com; PackageReference: TO-252; ComponentLink1Description: Manufacturer URL; ComponentLink2Description: Datasheet; PackageVersion: 2011; PackageDescription: 3-Pin Transistor Outline Package 2.28 mm Pitch, 9.7 mm Lead Span (DPAK); DatasheetVersion: 11/07/2011; Supplier 1: Mouser; Manufacturer Part Number: LD1086DT33TR; Stock 1: 11431; Pricing 1: 1=0.97000, 10=0.83500, 50=0.83500, 100=0.64100, 1000=0.44700, 10000=0.38200 (USD); RoHS: Yes; Mount: Surface Mount; Case/Package: DPAK; Number of Pins: 3; Weight: 0.01lb; Min Operating Temperature: -40°C; Max Operating Temperature: 125°C; Output Voltage: 3.3V; Packaging: Tape and Reel; Max Output Current: 1.5A; Output Current: 1.5A; Package Quantity: 1; Polarity: Positive; Nominal Output Voltage: 3.3V; Number of Regulators: 1; Min Output Voltage: 3.3V; Output Voltage Accuracy: 1%; Length: 6.6mm; Height: 2.4mm; Width: 6.2mm; Radiation Hardening: No; REACH SVHC: No SVHC; Lead Free: Lead Free; ComponentLink3URL: https://datasheet.ciiva.com/16593/cd00001884-16593328.pdf?src-supplier=Avnet+Europe; ComponentLink3Description: https://datasheet.ciiva.com/16593/cd00001884-16593328.pdf?src-supplier=Avnet+Europe; ComponentLink4URL: https://datasheet.ciiva.com/2043/cd00001884-2043961.pdf?src-supplier=Digi-Key; ComponentLink4Description: https://datasheet.ciiva.com/2043/cd00001884-2043961.pdf?src-supplier=Digi-Key; ComponentLink5URL: https://datasheet.ciiva.com/3225/cd00001884-3225081.pdf?src-supplier=Avnet; ComponentLink5Description: https://datasheet.ciiva.com/3225/cd00001884-3225081.pdf?src-supplier=Avnet; ComponentLink6URL: https://datasheet.ciiva.com/1511/1880971-1511549.pdf?src-supplier=Element14; ComponentLink6Description: https://datasheet.ciiva.com/1511/1880971-1511549.pdf?src-supplier=Element14; ComponentLink7URL: https://datasheet.ciiva.com/1511/1880971-1511550.pdf?src-supplier=Element14; ComponentLink7Description: https://datasheet.ciiva.com/1511/1880971-1511550.pdf?src-supplier=Element14; ComponentLink8URL: https://datasheet.ciiva.com/2043/cd00001884-2043960.pdf?src-supplier=Digi-Key; ComponentLink8Description: https://datasheet.ciiva.com/2043/cd00001884-2043960.pdf?src-supplier=Digi-Key; ComponentLink9URL: https://datasheet.ciiva.com/2043/cd00001884-2043962.pdf?src-supplier=Digi-Key; ComponentLink9Description: https://datasheet.ciiva.com/2043/cd00001884-2043962.pdf?src-supplier=Digi-Key; ComponentLink10URL: https://datasheet.ciiva.com/16496/cd00001884-16496030.pdf?src-supplier=Future+Electronics; ComponentLink10Description: https://datasheet.ciiva.com/16496/cd00001884-16496030.pdf?src-supplier=Future+Electronics

## Sheet ST_LINK_V3E.SchDoc: STLINK_V3E
size A3; Date: Not used; ApprovedBy: Not used; CheckedBy: Not used; Author: Not used; CompanyName: STMicroelectronics; DrawnBy: Not used; Engineer: Not used; Organization: Not used; Address1: Not used; Address2: Not used; Address3: Not used; Address4: Not used; DocumentNumber: 10; Revision: Not used; SheetNumber: 9; SheetTotal: 9; CurrentTime: Not used; CurrentDate: Not used; Time: Not used; DocumentFullPathAndName: Not used; DocumentName: Not used; ModifiedDate: Not used; ImagePath: Not used; ProjectName: Not used; Application_BuildNumber: Not used
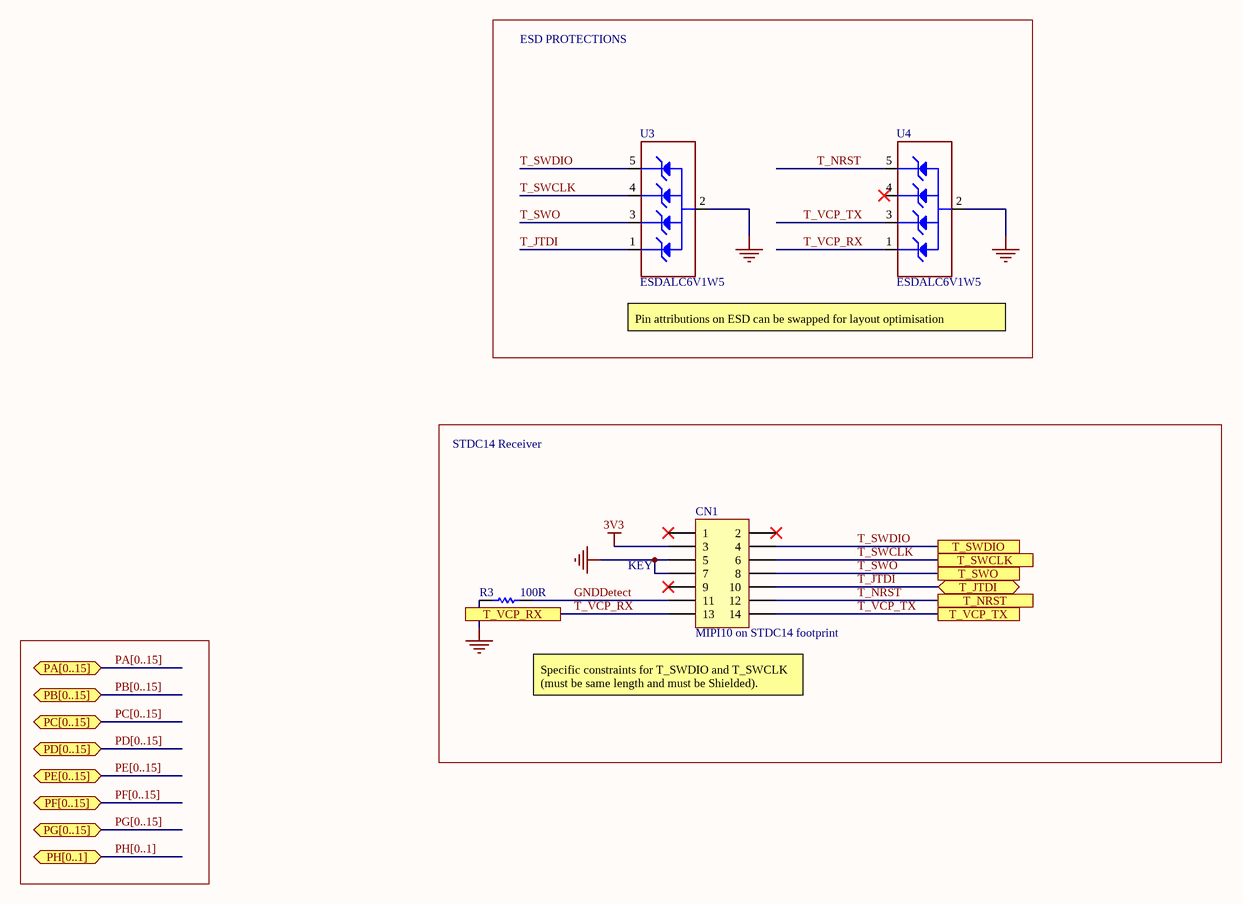
[diagram p3: ST_LINK_V3E.SchDoc]

### Parts
CN1  value MIPI10 on STDC14 footprint  [CON_STDC14_Receiver_MEDIUM_WITH_MIPI10_3D]  (hidden comment: Header 7x2)
R3  value 100R  [R0402]  (hidden comment: Resistor)
U3  ESDALC6V1W5  [ESD_SOT323-5L]
U4  ESDALC6V1W5  [ESD_SOT323-5L]

### Blocks framed on the sheet
ESD PROTECTIONS: U3 U4

### Ports
PA[0..15] (bidir), PB[0..15] (bidir), PC[0..15] (bidir), PD[0..15] (bidir), PE[0..15] (bidir), PF[0..15] (bidir), PG[0..15] (bidir), PH[0..1] (bidir), T_JTDI (bidir), T_NRST, T_SWCLK, T_SWDIO, T_SWO, T_VCP_RX, T_VCP_TX

### Nets
3V3: CN1.3
GND: CN1.5 CN1.7 R3.1 U3.2(GND) U4.2(GND)
GNDDetect: CN1.11 R3.2
T_JTDI: CN1.10 U3.1(IO1) ; port T_JTDI  [project net PA15]
T_NRST: CN1.12 U4.5(IO4) ; port T_NRST
T_SWCLK: CN1.6 U3.4(IO3) ; port T_SWCLK
T_SWDIO: CN1.4 U3.5(IO4) ; port T_SWDIO
T_SWO: CN1.8 U3.3(IO2) ; port T_SWO
T_VCP_RX: CN1.13 U4.1(IO1) ; port T_VCP_RX
T_VCP_TX: CN1.14 U4.3(IO2) ; port T_VCP_TX

Not connected (* = marked no-connect by the designer): CN1 1* 2* 9*; U4 4(IO3)*

### Buses and harness runs
bus PA[0..15] = port PA[0..15]
bus PB[0..15] = port PB[0..15]
bus PC[0..15] = port PC[0..15]
bus PD[0..15] = port PD[0..15]
bus PE[0..15] = port PE[0..15]
bus PF[0..15] = port PF[0..15]
bus PG[0..15] = port PG[0..15]
bus PH[0..1] = port PH[0..1]

### Notes on the sheet
- Pin attributions on ESD can be swapped for layout optimisation
- STDC14 Receiver
- (near CN1) KEY
- Specific constraints for T_SWDIO and T_SWCLK (must be same length and must be Shielded).
- Title:
- Project:
- Size:
- Revision:
- Variant:
- A3
- -
- Date:
- Reference:
- Sheet:
- of

### Library data of the parts
CN1 = MCD-01226: Header 5x2, 1.27mm, Dual row, Straight, Surface mount, vertical male connector. 3.05mm lead. Mates with FFSD connector. Footprint compatible with FTSH-107-01-L-DV,-K,-A,-P,-ES (STDC14 MEDIUM); Manufacturer_Part_Number: FTSH-105-01-L-DV-K; Manufacturer: SAMTEC; Alternate_Manufacturer_Part_Number: P127B-2x05MGF-079-1A; Alternate_Manufacturer: JIUBABA; Provided_By: SUBCO; Internal_Part_Number: MCD-01226; Status: Released; Part_Type: Connector; ComponentLink1Description: Datasheet; ComponentLink1URL: http://tunmcdsvn.tun.st.com/Component_Datasheet_Library/Trunk/Connectors/Samtec_FTSH_smt_series; ECCN_US: n/a; ECCN_EU: n/a
R3 = MCD-00119: Resistor,100R,0402,1%,1/16W; Manufacturer_Part_Number: RC0402FR-07100RL; Manufacturer: YAGEO; Provided_By: SUBCO; ECCN_US: EAR99; ECCN_EU: NEC; Internal_Part_Number: MCD-00119; Status: Released; Part_Type: Resistor; ComponentLink1Description: Datasheet; Package: R0402; ComponentLink1URL: http://tunmcdsvn.tun.st.com/Component_Datasheet_Library/Trunk/Resistors/Yageo_Resistor_RC0402-series
U3 U4 = MCD-00136: Dual Transil array for ESD protection; Part_Type: Diode; Manufacturer: STMICROELECTRONICS; BMS_Part_Number: 9151112; Provided_By: SUBCO with ST control; ECCN_US: EAR99; ECCN_EU: NEC; Internal_Part_Number: MCD-00136; Value: ESDALC6V1W5; Status: Released; Manufacturer_Part_Number: ESDALC6V1W5; ComponentLink1Description: Datasheet; ComponentLink1URL: http://tunmcdsvn.tun.st.com/Component_Datasheet_Library/Trunk/Diodes/STM_ESD_ESDALC6V1W5